# Altium schematic sheet 01-POWER.SchDoc
size A4; SPICEModelCacheWPLWZTGZ: <root> / <DocumentId>WPLWZTGZ</DocumentId> / </root>; 学校: 辽宁工程技术大学; 考号: 2107010403; 证件号: 532124200305070711; 图号: 第1幅; 图号数: 总共7幅; SheetNumber: 1; SheetTotal: 6; 单位名称: 辽宁工程技术大学; 身份证号: 532124200305070711; 姓名: 邓祥涛; 图名: mydesign; 选手编号: 84011514
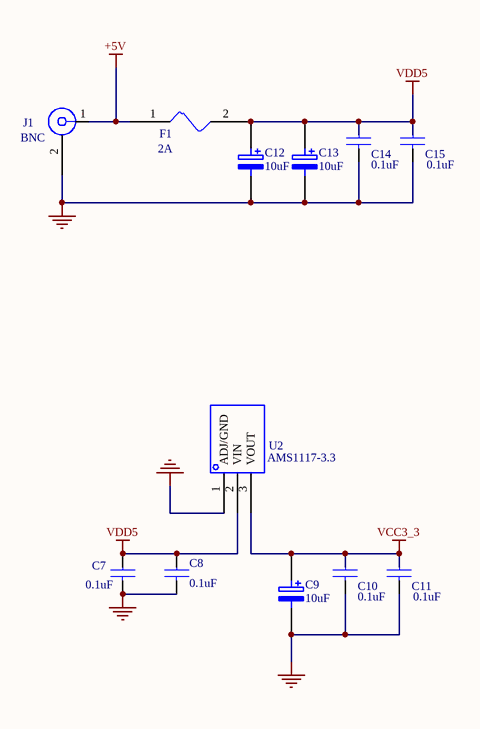
[diagram p0: 01-POWER.SchDoc]

## Parts
C7  value 0.1uF  [0805-C]  (hidden comment: 10uF)
C8  0.1uF  [C0603]
C9  10uF  [3528-C]
C10  0.1uF  [C0603]
C11  0.1uF  [C0603]
C12  10uF  [3528-C]
C13  10uF  [3528-C]
C14  0.1uF  [1206-C]
C15  0.1uF  [1206-C]
F1  value 2A  [1206-F]  (hidden comment: FUSE)
J1  BNC  [DC-005B]
U2  value AMS1117-3.3  [SOT-89]  (hidden comment: 3.3_TO_1_0.8_VOLTAGE_REGULATOR)

## Nets
+5V: F1.1 J1.1(CENTER)
GND: C7.2 C8.2 C9.2 C10.2 C11.2 C12.2 C13.2 C14.2 C15.2 J1.2(SHIELD) U2.1(ADJ/GND)
VCC3_3: C9.1 C10.1 C11.1 U2.3(VOUT)
VDD5: C7.1 C8.1 C12.1 C13.1 C14.1 C15.1 F1.2 U2.2(VIN)

## Notes on the sheet
- 单位名称
- 选手信息
- 图名
- 文件名
- 当前日期
- 第
- 幅
- 当前时间
- 总共

## Library data of the parts
C7 C8 C10 C11 C14 C15 = CAP: PART_SHAPE: 0805; PCB DECAL: 0603; SOURCE_PATH: C:\ORCADWIN\CAPTURE\LIBRARY\CHRONTEL.OLB
  C8 C10 C11 C14 C15: VALUE: 0.1uF
C9 C12 C13 = ELECTRO2: Electrolytic Capacitor
F1 = FUSE: PCB DECAL: MINISMDC050CT; SOURCE_PATH: C:\PROGRAM FILES\ORCAD\CAPTURE\LIBRARY\DISCRETE.OLB
J1 = BNC: PCB DECAL: RCA-101; SOURCE_PATH: C:\PROGRAM FILES\印院出品\CAPTURE 16.2\LIBRARY\CONNECTOR.OLB; VALUE: BNC
U2 = 3.3_TO_1_0.8_VOLTAGE_REGULATOR: SOURCE_PATH: D:\COMPANY\MYPROJECT\CT320\EVABOARD\REVB\CT320EVB0.1.DSN; PCB DECAL: SOT-89